# Altium schematic sheet ComandosExt.SchDoc
size A4; SheetNumber: 5; SheetTotal: 10
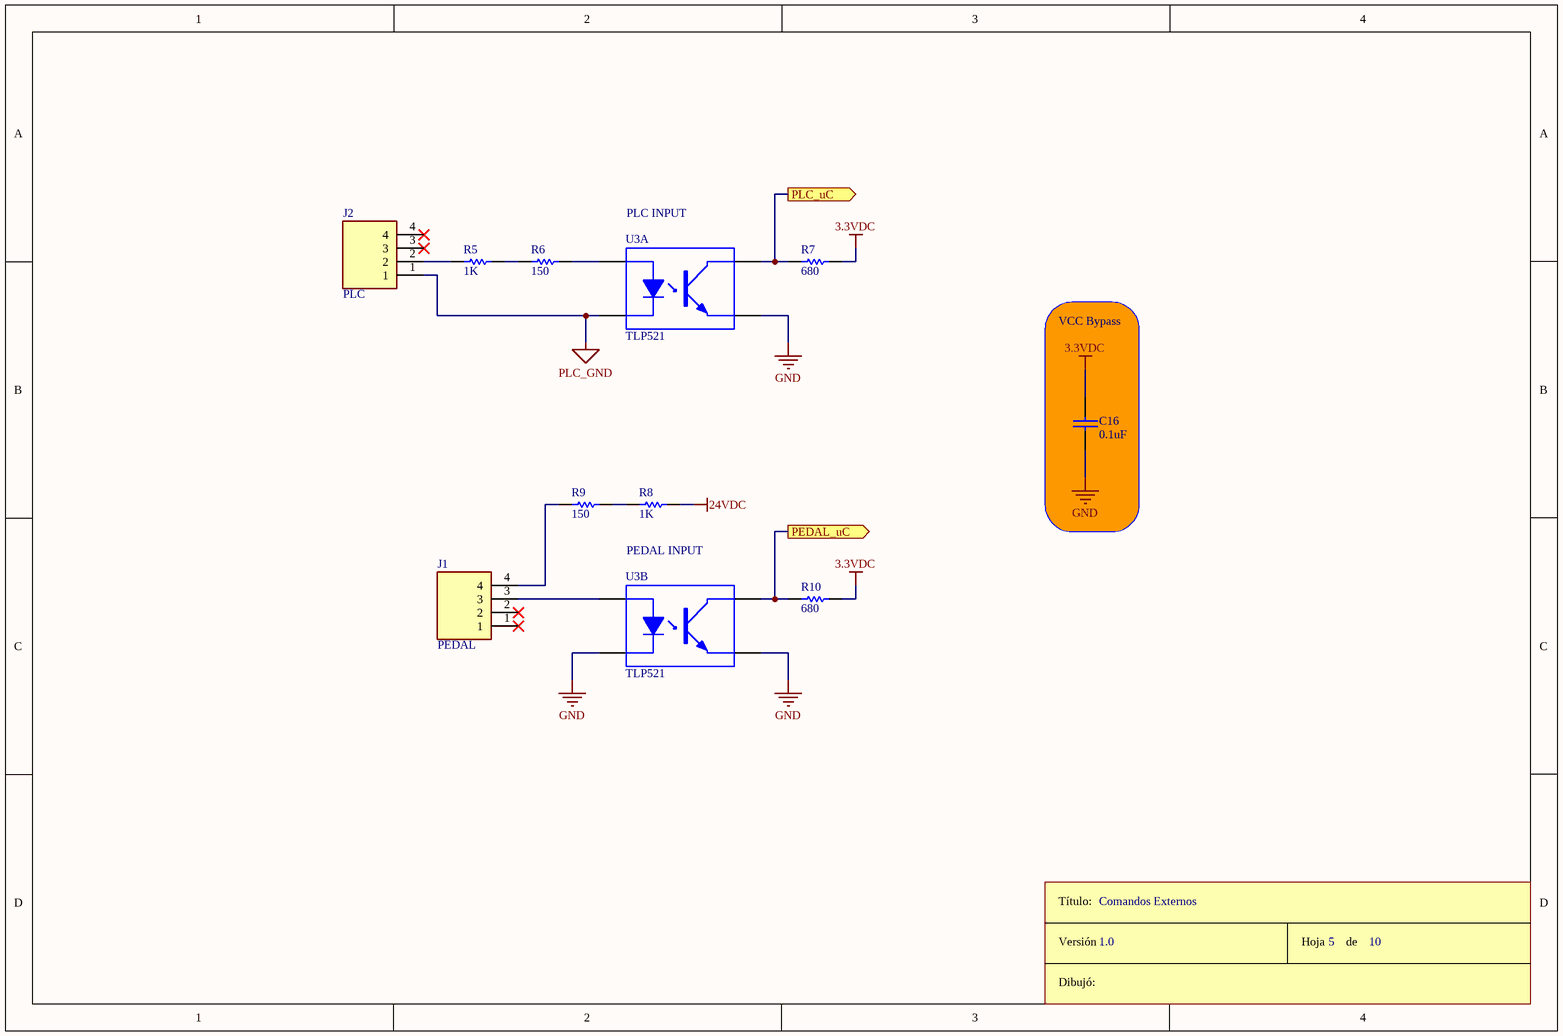
[diagram p0: ComandosExt.SchDoc]

## Parts
C16  0.1uF  [CAP100]
J1  PEDAL  [TE_1586863-4]
J2  PLC  [TE_1586863-4]
R5  1K  [RES300]
R6  150  [RES300]
R7  680  [RES300]
R8  1K  [RES300]
R9  150  [RES300]
R10  680  [RES300]
ROT3  Rótulo  (value not drawn)  (graphical)
U3  TLP521  [DIP8]  (parts A,B of 2)

## Blocks framed on the sheet
VCC Bypass: C16

## Ports
PEDAL_uC (out), PLC_uC (out)

## Nets
3.3VDC: C16.1 R7.2 R10.2
24VDC: R8.1
GND: C16.2 U3.4(K) U3.5(E) U3.7(E)
PLC_GND: J2.1 U3.2(K)
PEDAL_uC: R10.1 U3.6(C) ; port PEDAL_uC
PLC_uC: R7.1 U3.8(C) ; port PLC_uC
NetJ1_3: J1.3 U3.3(A)
NetJ1_4: J1.4 R9.2
NetJ2_2: J2.2 R5.1
NetR5_2: R5.2 R6.1
NetR6_2: R6.2 U3.1(A)
NetR8_2: R8.2 R9.1

Not connected (* = marked no-connect by the designer): J1 1* 2*; J2 3* 4*

## Notes on the sheet
- (near U3) PLC INPUT
- PEDAL INPUT
- Comandos Externos
- 1.0
- 5
- 10
- (in symbol Rótulo) Título:; Versión; Hoja       de; Dibujó:

## Library data of the parts
C16 = CAP
J1 J2 = 1586863-4: Conn Power HDR 4 POS 4.2mm Solder RA Thru-Hole 4 Terminal 1 Port Tray; MF: TE Connectivity; Price: None; Value: *; TE_purchase_URL: https://www.te.com/usa-en/product-1586863-4.html?te_bu=Cor&te_type=disp&te_campaign=seda_glo_cor-seda-global-disp-prtnr-fy19-seda-model-bom-cta_sma-317_1&elqCampaignId=32493; SnapEDA_Link: https://www.snapeda.com/parts/1586863-4/TE%20Connectivity%20AMP%20Connectors/view-part/1401879/?ref=snap; Package: None; EU_RoHS_Compliance: Compliant; Availability: Unavailable; MP: 1586863-4
R5-R10 = RES
U3 = TLP521-2: PhotoCoupler